# EAGLE design CNC-InterfaceBoard (EAGLE 6.3)
CNC Control Panel Interface Board SPI slave interface Passthrough topology (external LPT master support) Crossbar switch using buffers MCU as crossbar switch controller Charge pump detection/generation E-Stop detection LED control for current master UI
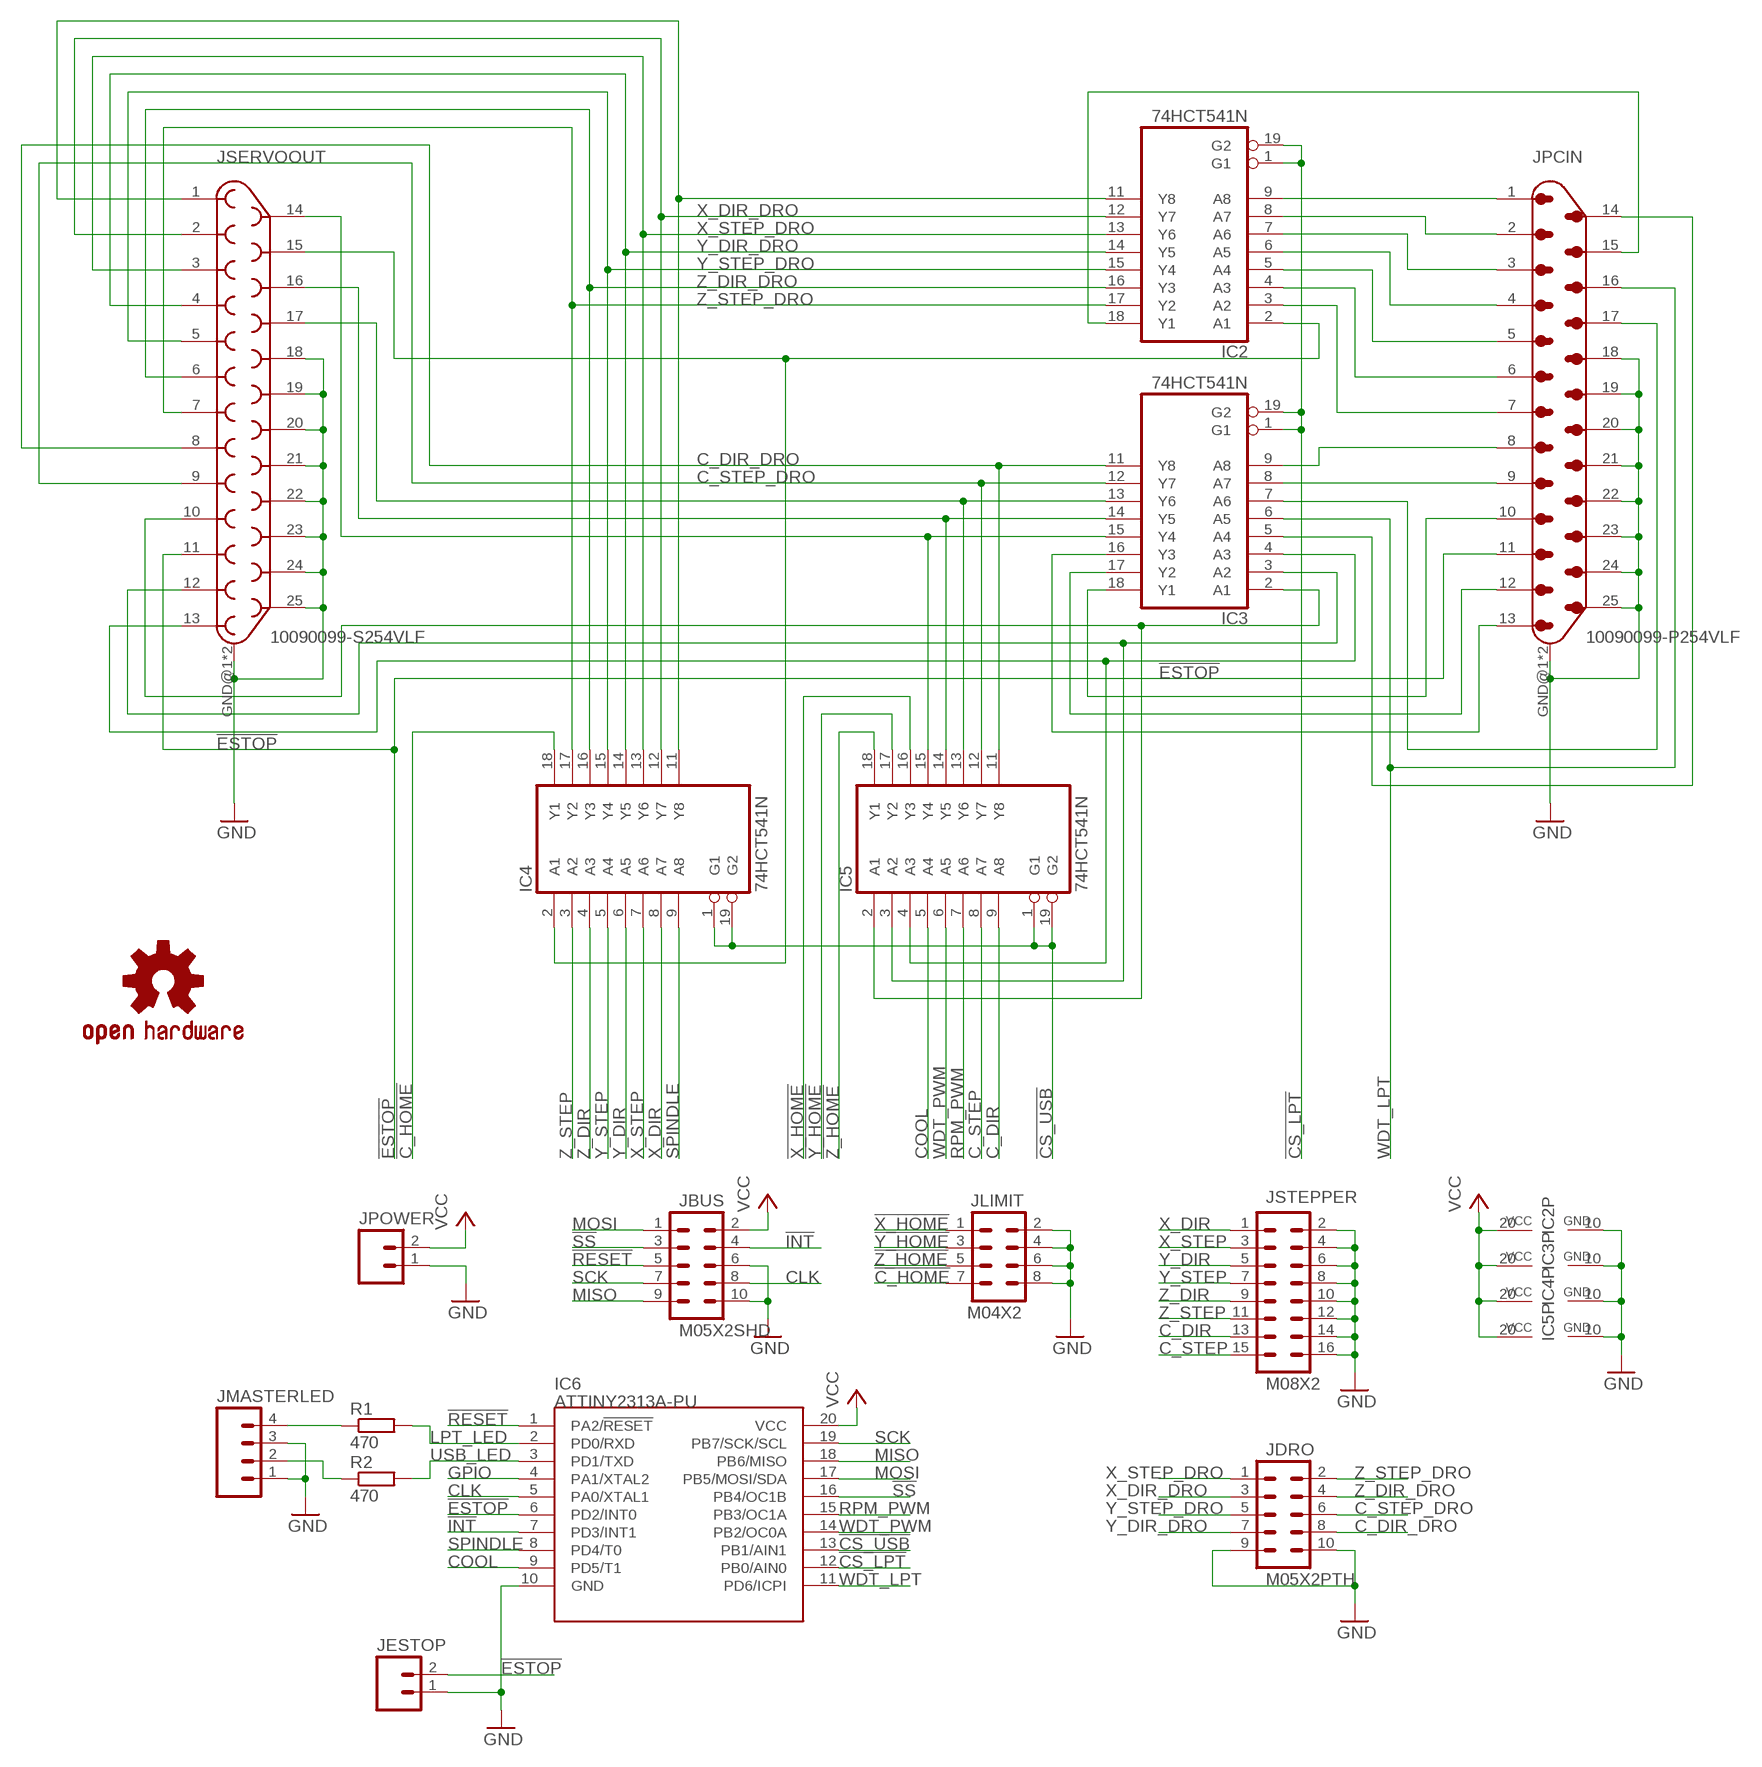
[diagram p0: schematic, sheet 1]

## Parts
IC2  74HCT541N  [DIL20]
IC3  74HCT541N  [DIL20]
IC4  74HCT541N  [DIL20]
IC5  74HCT541N  [DIL20]
IC6  ATTINY2313A-PU  [DIP254P762X533-20]
JBUS  M05X2SHD  [2X5-SHROUDED]
JDRO  M05X2PTH  [AVR_ICSP]
JESTOP  M02PTH  [1X02]
JLIMIT  M04X2  [2X4]
JMASTERLED  M04PTH  [1X04]
JPCIN  10090099-P254VLF  [10090099-P254VLF]
JPOWER  M02POLAR  [MOLEX-1X2]
JSERVOOUT  10090099-S254VLF  [10090099-S254VLF]
JSTEPPER  M08X2  [2X8]
R1  470  R-EU_0207/10  [0207/10]
R2  470  R-EU_0207/10  [0207/10]
U$1  SPARKFUN_OSHW-LOGOL  [SPARKFUN_OSHW-LOGO-L]

## Nets
!C_HOME: IC4.18(Y1) JLIMIT.7
!CS_LPT: IC2.1(G1) IC2.19(G2) IC3.1(G1) IC3.19(G2) IC6.12(PB0/AIN0)
!CS_USB: IC4.1(G1) IC4.19(G2) IC5.1(G1) IC5.19(G2) IC6.13(PB1/AIN1)
!ESTOP: IC6.6(PD2/INT0) JESTOP.2 JPCIN.11 JSERVOOUT.11
!INT: IC6.7(PD3/INT1) JBUS.4
!RESET: IC6.1(PA2/!RESET) JBUS.5
!SS: IC6.16(PB4/OC1B) JBUS.3
!X_HOME: IC5.16(Y3) JLIMIT.1
!Y_HOME: IC5.17(Y2) JLIMIT.3
!Z_HOME: IC5.18(Y1) JLIMIT.5
C_DIR: IC5.9(A8) JSTEPPER.13
C_DIR_DRO: IC3.11(Y8) IC5.11(Y8) JDRO.8 JSERVOOUT.8
C_STEP: IC5.8(A7) JSTEPPER.15
C_STEP_DRO: IC3.12(Y7) IC5.12(Y7) JDRO.6 JSERVOOUT.9
CLK: IC6.5(PA0/XTAL1) JBUS.8
COOL: IC5.5(A4) IC6.9(PD5/T1)
GND: IC2.10(GND) IC3.10(GND) IC4.10(GND) IC5.10(GND) IC6.10(GND) JBUS.6 JBUS.10 JDRO.9 JDRO.10 JESTOP.1 JLIMIT.2 JLIMIT.4 JLIMIT.6 JLIMIT.8 JMASTERLED.1 JMASTERLED.3 JPCIN.18 JPCIN.19 JPCIN.20 JPCIN.21 JPCIN.22 JPCIN.23 JPCIN.24 JPCIN.25 JPCIN.GND@1(GND) JPCIN.GND@2(GND) JPOWER.1 JSERVOOUT.18 JSERVOOUT.19 JSERVOOUT.20 JSERVOOUT.21 JSERVOOUT.22 JSERVOOUT.23 JSERVOOUT.24 JSERVOOUT.25 JSERVOOUT.GND@1(GND) JSERVOOUT.GND@2(GND) JSTEPPER.2 JSTEPPER.4 JSTEPPER.6 JSTEPPER.8 JSTEPPER.10 JSTEPPER.12 JSTEPPER.14 JSTEPPER.16
GPIO: IC6.4(PA1/XTAL2)
LPT_LED: IC6.2(PD0/RXD) R1.2
MISO: IC6.18(PB6/MISO) JBUS.9
MOSI: IC6.17(PB5/MOSI/SDA) JBUS.1
N$1: IC2.9(A8) JPCIN.1
N$2: IC2.8(A7) JPCIN.2
N$3: IC2.7(A6) JPCIN.3
N$4: IC2.6(A5) JPCIN.4
N$5: IC2.5(A4) JPCIN.5
N$6: IC2.4(A3) JPCIN.6
N$7: IC2.3(A2) JPCIN.7
N$8: IC3.9(A8) JPCIN.8
N$9: IC3.8(A7) JPCIN.9
N$10: IC3.5(A4) JPCIN.14
N$11: JMASTERLED.2 R2.1
N$12: IC3.2(A1) IC5.2(A1) JSERVOOUT.10
N$13: IC3.3(A2) IC5.3(A2) JSERVOOUT.12
N$14: IC3.7(A6) JPCIN.17
N$15: IC3.4(A3) IC5.4(A3) JSERVOOUT.13
N$16: JMASTERLED.4 R1.1
N$17: IC3.16(Y3) JPCIN.13
N$18: IC3.17(Y2) JPCIN.12
N$19: IC2.18(Y1) JPCIN.15
N$21: IC3.18(Y1) JPCIN.10
N$22: IC3.15(Y4) IC5.15(Y4) JSERVOOUT.14
N$23: IC3.14(Y5) IC5.14(Y5) JSERVOOUT.16
N$24: IC3.13(Y6) IC5.13(Y6) JSERVOOUT.17
N$34: IC2.2(A1) IC4.2(A1) JSERVOOUT.15
N$38: IC2.11(Y8) IC4.11(Y8) JSERVOOUT.1
RPM_PWM: IC5.7(A6) IC6.15(PB3/OC1A)
SCK: IC6.19(PB7/SCK/SCL) JBUS.7
SPINDLE: IC4.9(A8) IC6.8(PD4/T0)
USB_LED: IC6.3(PD1/TXD) R2.2
VCC: IC2.20(VCC) IC3.20(VCC) IC4.20(VCC) IC5.20(VCC) IC6.20(VCC) JBUS.2 JPOWER.2
WDT_LPT: IC3.6(A5) IC6.11(PD6/ICPI) JPCIN.16
WDT_PWM: IC5.6(A5) IC6.14(PB2/OC0A)
X_DIR: IC4.8(A7) JSTEPPER.1
X_DIR_DRO: IC2.12(Y7) IC4.12(Y7) JDRO.3 JSERVOOUT.2
X_STEP: IC4.7(A6) JSTEPPER.3
X_STEP_DRO: IC2.13(Y6) IC4.13(Y6) JDRO.1 JSERVOOUT.3
Y_DIR: IC4.6(A5) JSTEPPER.5
Y_DIR_DRO: IC2.14(Y5) IC4.14(Y5) JDRO.7 JSERVOOUT.4
Y_STEP: IC4.5(A4) JSTEPPER.7
Y_STEP_DRO: IC2.15(Y4) IC4.15(Y4) JDRO.5 JSERVOOUT.5
Z_DIR: IC4.4(A3) JSTEPPER.9
Z_DIR_DRO: IC2.16(Y3) IC4.16(Y3) JDRO.4 JSERVOOUT.6
Z_STEP: IC4.3(A2) JSTEPPER.11
Z_STEP_DRO: IC2.17(Y2) IC4.17(Y2) JDRO.2 JSERVOOUT.7

## Library data of the parts
IC2-IC5 = 74xx-eu:74*541: Octal BUFFER and LINE DRIVER, 3-state
IC6 = SparkFun-DigitalIC:ATTINY2313A: Atmel ATtiny2313A 2KiB Flash, 128 Bytes SRAM, 128 Bytes EEPROM 18 GPIO, USART, USI, picoPower DIP and SOIC packages provided
JBUS JDRO = SparkFun-Connectors:M05X2: Header 5x2 Standard 10-pin dual row 0.1" header. Commonly used with AVR-ISP. Use with Spark Fun Electronics SKU: PRT-00778
JESTOP JPOWER = SparkFun-Connectors:M02: Header 2 Standard 2-pin 0.1" header. Use with straight break away headers (SKU : PRT-00116), right angle break away headers (PRT-00553), swiss pins (PRT-00743), machine pins (PRT-00117), and female headers (PRT-00115). Molex polarized connector foot print use with SKU : PRT-08233 with associated crimp pins and housings.
JLIMIT = SparkFun-Connectors:M04X2: .1" header, two rows of four.
JMASTERLED = SparkFun-Connectors:M04: Header 4 Standard 4-pin 0.1" header. Use with straight break away headers (SKU : PRT-00116), right angle break away headers (PRT-00553), swiss pins (PRT-00743), machine pins (PRT-00117), and female headers (PRT-00115). Molex polarized connector foot print use with SKU : PRT-08231 with associated crimp pins and housings. 1MM SMD Version SKU: PRT-10208
JPCIN = radu-collected:10090099-P254VLF: FCI 10090099-P254[VLX]LF DB-25 male connector, right angle PCB mount
JSERVOOUT = radu-collected:10090099-S254VLF: FCI 10090099-S254[VLX]LF DB-25 female connector, right angle PCB mount
JSTEPPER = SparkFun-Connectors:M08X2: .1" headers, two rows of 8 each
R1 R2 = rcl:R-EU_: RESISTOR, European symbol
U$1 = Si4735_Breakout-v10:SPARKFUN_OSHW-LOGO: Open Source Hardware Logo This logo indicates the piece of hardware it is found on incorporates a OSHW license and/or adheres to the definition of open source hardware found here: http://freedomdefined.org/OSHW

## Net classes
0 default: width 0.254 mm, clearance 0.318 mm

## Board
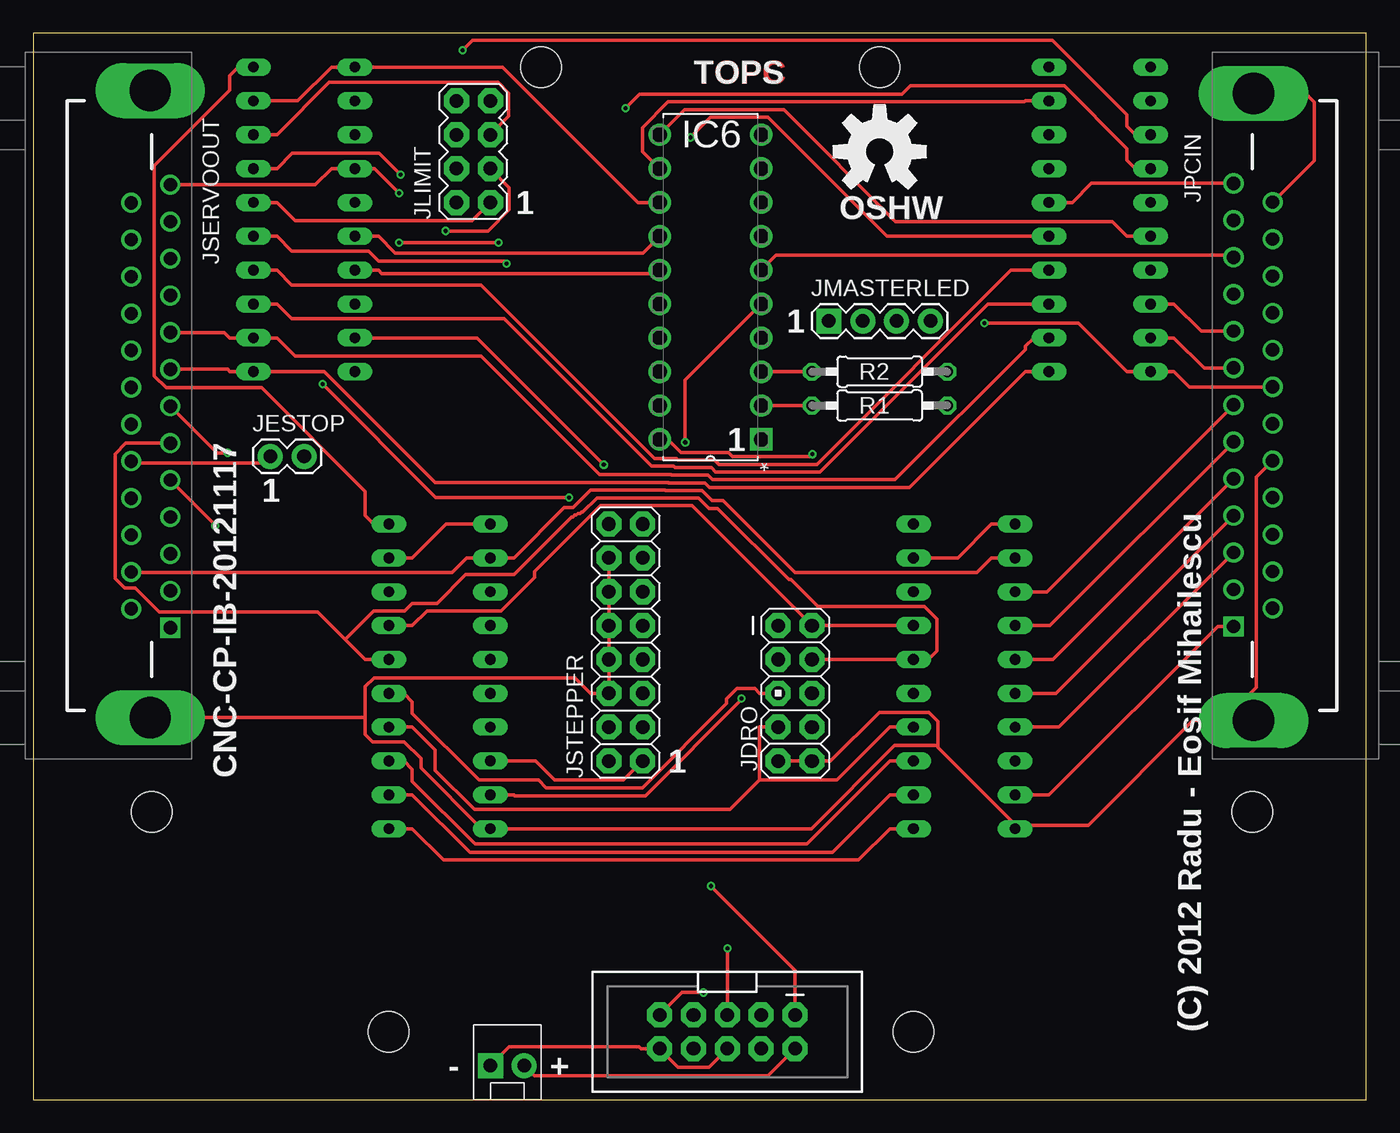
[diagram p1: board, top side]
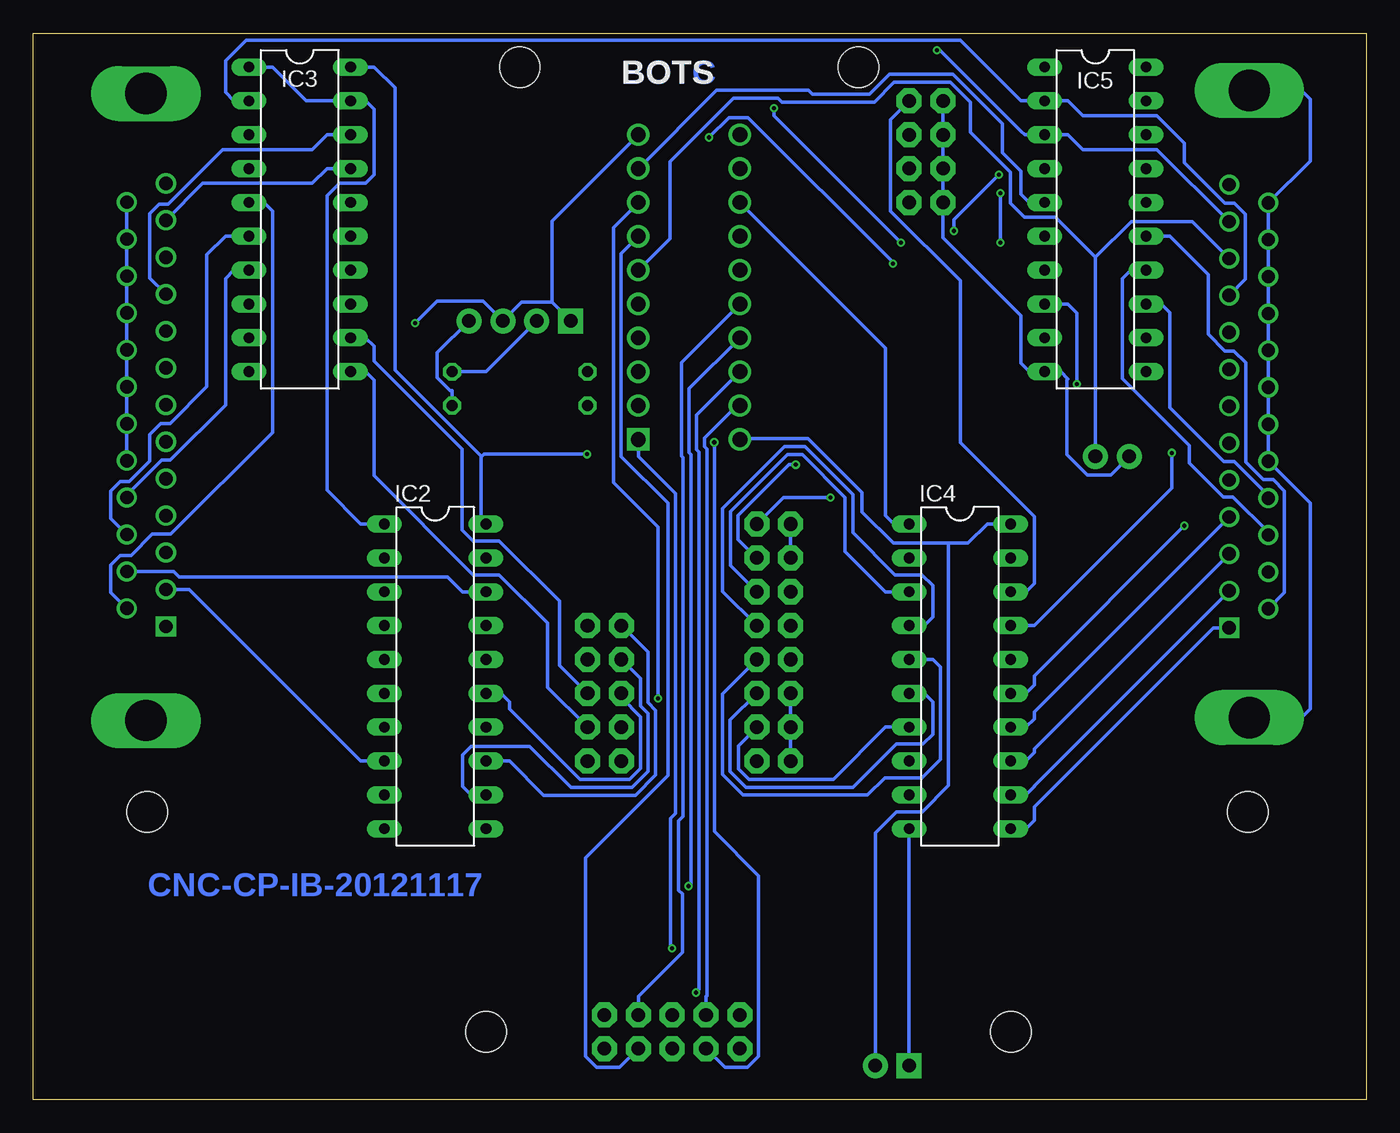
[diagram p2: board, bottom side, seen from below]

Size 100 x 80 mm. Coordinates in mm from the lower left corner, seen from the top.
Outline: 0,0 100,0 100,80 0,80 0,0
Copper layers (1*16): Top 0.035mm / dielectric 1.5mm / Bottom 0.035mm
Design rules "ITEADstudio_DRC": minimum track width 6mil, minimum drill 12mil, track to track 6mil, track to pad 6mil, pad to pad 6mil, via to via 6mil, smd to smd 0mil, copper to edge 10mil, drill to drill 10mil, minimum pad ring 10mil, minimum via ring 6mil, stop-mask expansion 2mil, vias tented up to drill 100mil, thermal gap 10mil
Holes 3.05 mm at 38.1,77.47 26.67,5.08 66.04,5.08 63.5,77.47 8.89,21.59 91.44,21.59

### Footprints (pad centres in the part's own frame; a part is rotated, then mirrored left to right if it is on the bottom)
DIL20 = drill 0.813 long: 1 -11.43,-3.81; 2 -8.89,-3.81; 3 -6.35,-3.81; 4 -3.81,-3.81; 5 -1.27,-3.81; 6 1.27,-3.81; 7 3.81,-3.81; 8 6.35,-3.81; 9 8.89,-3.81; 10 11.43,-3.81; 11 11.43,3.81; 12 8.89,3.81; 13 6.35,3.81; 14 3.81,3.81; 15 1.27,3.81; 16 -1.27,3.81; 17 -3.81,3.81; 18 -6.35,3.81; 19 -8.89,3.81; 20 -11.43,3.81
DIP254P762X533-20 = drill 1.118 square: 1 -7.62,22.86 | drill 1.118: 2 -7.62,20.32; 3 -7.62,17.78; 4 -7.62,15.24; 5 -7.62,12.7; 6 -7.62,10.16; 7 -7.62,7.62; 8 -7.62,5.08; 9 -7.62,2.54; 10 -7.62,0; 11 0,0; 12 0,2.54; 13 0,5.08; 14 0,7.62; 15 0,10.16; 16 0,12.7; 17 0,15.24; 18 0,17.78; 19 0,20.32; 20 0,22.86
2X5-SHROUDED = drill 1.016 pad 1.88 octagon: 1 -1.27,5.08; 2 1.27,5.08; 3 -1.27,2.54; 4 1.27,2.54; 5 -1.27,0; 6 1.27,0; 7 -1.27,-2.54; 8 1.27,-2.54; 9 -1.27,-5.08; 10 1.27,-5.08
AVR_ICSP = drill 1.016 pad 1.88 octagon: 1 -1.27,5.08; 2 1.27,5.08; 3 -1.27,2.54; 4 1.27,2.54; 5 -1.27,0; 6 1.27,0; 7 -1.27,-2.54; 8 1.27,-2.54; 9 -1.27,-5.08; 10 1.27,-5.08
1X02 = drill 1.016 pad 1.88: 1 0,0; 2 2.54,0
2X4 = drill 1.016 pad 1.88 octagon: 1 -3.81,-1.27; 2 -3.81,1.27; 3 -1.27,-1.27; 4 -1.27,1.27; 5 1.27,-1.27; 6 1.27,1.27; 7 3.81,-1.27; 8 3.81,1.27
1X04 = drill 1.016 pad 1.88 square: 1 0,0 | drill 1.016 pad 1.88: 2 2.54,0; 3 5.08,0; 4 7.62,0
10090099-P254VLF = drill 1 square: 1 -1.39,-16.57 | drill 1: 2 -1.39,-13.8; 3 -1.39,-11.03; 4 -1.39,-8.26; 5 -1.39,-5.49; 6 -1.39,-2.72; 7 -1.39,0.05; 8 -1.39,2.82; 9 -1.39,5.59; 10 -1.39,8.36; 11 -1.39,11.13; 12 -1.39,13.9; 13 -1.39,16.67; 14 1.545,-15.215; 15 1.545,-12.445; 16 1.545,-9.675; 17 1.545,-6.905; 18 1.545,-4.135; 19 1.545,-1.365; 20 1.545,1.405; 21 1.545,4.175; 22 1.545,6.945; 23 1.545,9.715; 24 1.545,12.485; 25 1.545,15.255 | drill 3.1 long: GND@1 0.12,23.41; GND@2 0.12,-23.63
MOLEX-1X2 = drill 1.016 pad 1.88 square: 1 0,0 | drill 1.016 pad 1.88: 2 2.54,0
10090099-S254VLF = drill 1 square: 1 -1.39,16.67 | drill 1: 2 -1.39,13.9; 3 -1.39,11.13; 4 -1.39,8.36; 5 -1.39,5.59; 6 -1.39,2.82; 7 -1.39,0.05; 8 -1.39,-2.72; 9 -1.39,-5.49; 10 -1.39,-8.26; 11 -1.39,-11.03; 12 -1.39,-13.8; 13 -1.39,-16.57; 14 1.545,15.255; 15 1.545,12.485; 16 1.545,9.715; 17 1.545,6.945; 18 1.545,4.175; 19 1.545,1.405; 20 1.545,-1.365; 21 1.545,-4.135; 22 1.545,-6.905; 23 1.545,-9.675; 24 1.545,-12.445; 25 1.545,-15.215 | drill 3.1 long: GND@1 0.12,23.41; GND@2 0.12,-23.63
2X8 = drill 1.016 pad 1.88 octagon: 1 0,0; 2 0,2.54; 3 2.54,0; 4 2.54,2.54; 5 5.08,0; 6 5.08,2.54; 7 7.62,0; 8 7.62,2.54; 9 10.16,0; 10 10.16,2.54; 11 12.7,0; 12 12.7,2.54; 13 15.24,0; 14 15.24,2.54; 15 17.78,0; 16 17.78,2.54
0207/10 = drill 0.813 octagon: 1 -5.08,0; 2 5.08,0

### Placement (x,y rotation side)
IC2  69.85,31.75 270 bottom
IC3  80.01,66.04 270 bottom
IC4  30.48,31.75 270 bottom
IC5  20.32,66.04 270 bottom
IC6  46.99,72.39 180 top
JBUS  52.07,5.08 270 top
JDRO  57.15,30.48 0 top
JESTOP  17.78,48.26 0 top
JLIMIT  33.02,71.12 90 top
JMASTERLED  59.69,58.42 0 top
JPCIN  91.44,52.07 0 top
JPOWER  34.29,2.54 0 top
JSERVOOUT  8.89,52.07 180 top
JSTEPPER  45.72,25.4 90 top
R1  63.5,52.07 180 top
R2  63.5,54.61 180 top
U$1  63.5,71.12 0 top

### Tracks (layer width: path | path; a pad name or v marks a point on that pad's centre or on a via)
!C_HOME
  Bottom 0.254: IC4.18 25.54,38.1 24.9,38.73 24.9,43.73 30.45,49.28 30.45,61.43 35.69,66.67 35.69,73.53 JLIMIT.7
!CS_LPT
  Top 0.254: IC3.19 74.43,74.93 74.36,74.86 47.63,74.86 45.7,72.94 45.7,71.14 IC6.12 | IC2.19 67.81,40.64 69.36,40.64 71.89,43.18 IC2.1
  Bottom 0.254: IC2.1 75.42,43.18 77.97,45.72 77.97,67.81 77.03,68.75 75.07,68.75 74.43,69.38 74.43,74.3 75.07,74.93 IC3.19 79.51,74.93 82.06,77.47 IC3.1
!CS_USB
  Top 0.254: IC6.13 45.37,67.31 35.21,77.47 IC5.1 22.36,77.47 19.82,74.93 17.39,74.93 IC5.19 | IC4.19 28.44,40.64 30.98,43.18 IC4.1
  Bottom 0.254: IC4.1 35.42,43.18 36.06,43.81 36.06,56.38 IC6.13
!ESTOP
  Top 0.254: IC6.6 55.73,63.35 89.9,63.35 JPCIN.11
  Bottom 0.254: 20.32,63.19 23.33,66.2 25.63,66.2 26.68,67.26 26.68,69.59 29.69,72.59 29.69,74.82 31.19,76.33 35.43,76.33 36.91,74.85 43.83,74.85 44.12,75.14 47.48,75.14 52.24,70.38 52.24,64.6 IC6.6 | 20.32,63.19 JESTOP.2 | JSERVOOUT.11 13.06,65.88 17.64,65.88 20.32,63.19
!INT
  Bottom 0.254: JBUS.4 56,2.42 57.74,2.42 58.55,3.23 58.55,18.14 52.39,24.3 52.39,44.74 55.89,48.25 55.89,63.49 IC6.7
!RESET  (via drill 0.3 pad 0.61)
  Top 0.254: JBUS.5 v52.07,11.34
  Bottom 0.254: v52.07,11.34 52.2,11.47 52.2,21.11 51.82,21.49 51.82,45.45 54.61,48.25 IC6.1
!SS
  Bottom 0.254: IC6.16 51.38,55.3 51.38,48.29 51.24,48.16 51.24,21.25 51.59,20.91 51.59,15.71 51.31,15.43 51.31,11.04 54.61,7.73 JBUS.3
!X_HOME
  Top 0.254: JLIMIT.1 32.91,65.92 19.66,65.92 18.28,67.31 IC5.16
!Y_HOME  (via drill 0.3 pad 0.61)
  Top 0.254: IC5.17 18.28,69.85 19.42,71 25.93,71 v27.55,69.38 | JLIMIT.3 35.71,68.43 35.71,66.75 34.13,65.17 v30.93,65.17
  Bottom 0.254: v30.93,65.17 30.93,66 v27.55,69.38
!Z_HOME
  Top 0.254: IC5.18 18.28,72.39 22.2,76.31 34.86,76.31 35.67,75.5 35.67,73.78 JLIMIT.5
C_DIR  (via drill 0.3 pad 0.61)
  Top 0.254: IC5.9 33.28,57.15 v42.8,47.63
  Bottom 0.254: v42.8,47.63 43.32,47.63 47.11,43.84 47.11,42.03 JSTEPPER.13
C_DIR_DRO
  Top 0.254: IC3.11 74.43,54.61 65.75,45.92 50.74,45.92 50.39,46.27 47.65,46.27 47.64,46.29 30.14,46.29 21.82,54.61 IC5.11 14.74,54.61 14.56,54.79 JSERVOOUT.8
  Bottom 0.254: IC3.11 75.07,54.61 74.43,53.98 74.43,46.81 66.99,39.37 65.04,39.37 61.42,35.75 61.42,30.94 JDRO.8
C_STEP  (via drill 0.3 pad 0.61)
  Top 0.254: v21.7,53.67 30.2,45.17 v40.19,45.17
  Bottom 0.254: JSTEPPER.15 43.73,45.17 v40.19,45.17 | v40.19,45.17 | IC5.8 22.36,59.69 21.7,59.02 v21.7,53.67
C_STEP_DRO
  Top 0.254: IC3.12 75.07,57.15 74.43,56.52 74.43,56.29 64.66,46.52 50.96,46.52 50.63,46.85 47.89,46.85 47.86,46.88 42.49,46.88 33.59,55.78 19.64,55.78 18.28,57.15 IC5.12 14.74,57.15 14.34,57.56 JSERVOOUT.9
  Bottom 0.254: IC3.12 75.07,57.15 74.43,56.52 74.43,55.42 67.82,48.81 67.82,42.74 66.99,41.91 65.04,41.91 60.53,37.4 60.53,32.59 JDRO.6
CLK  (via drill 0.3 pad 0.61)
  Top 0.254: v48.91,49.31 48.91,53.99 IC6.5
  Bottom 0.254: JBUS.8 48.12,2.4 46.44,2.4 45.59,3.25 45.59,16.8 48.9,20.1 48.9,49.3 v48.91,49.31
COOL
  Bottom 0.254: IC5.5 25.26,67.31 25.89,67.94 25.89,69.65 27.28,71.03 27.28,73.22 30.99,76.94 35.76,76.94 37.27,75.42 41.54,75.42 41.83,75.72 48.74,75.72 IC6.9
GND  (via drill 0.3 pad 0.61)
  Top 0.254: 67.87,26.55 64.61,26.55 58.38,20.32 IC4.10 33.63,20.32 29.08,24.87 29.08,25.58 27.83,26.84 25.48,26.84 24.9,27.41 24.9,28.66 | JSERVOOUT.18 7.47,47.77 17.29,47.77 JESTOP.1 | JPCIN.GND@1 95.49,75.48 96.12,74.84 96.12,70.46 JPCIN.25 | 89.28,28.44 91.77,30.93 91.77,46.72 JPCIN.18 | 89.28,28.44 87,28.44 79.14,20.58 73.72,20.58 | JPCIN.GND@2 89.28,28.44 | 73.72,20.58 73.72,20.38 IC2.10 | 67.87,26.55 67.87,26.43 73.72,20.58 | JSTEPPER.14 JSTEPPER.12 JSTEPPER.10 JSTEPPER.8 JSTEPPER.6 41.8,30.48 40.65,31.63 25.55,31.63 24.9,30.98 24.9,28.66 | JPCIN.20 86.72,53.48 85.58,54.61 IC3.10 82.06,54.61 78.41,58.26 v71.36,58.26 | 67.87,26.55 67.87,28.38 67.19,29.06 63.46,29.06 59.8,25.4 JDRO.10 JDRO.9 | 24.9,28.66 13.33,28.66 JSERVOOUT.GND@1 | JBUS.6 50.68,2.42 48.38,2.42 JBUS.10 45.6,3.81 45.46,3.95 35.7,3.95 JPOWER.1
  Bottom 0.254: JESTOP.1 19.17,46.87 20.93,46.87 22.45,48.38 22.45,53.98 22.36,54.06 22.91,54.61 IC5.10 25.26,54.61 25.89,55.24 25.89,58.83 31.75,64.68 31.75,65.92 JLIMIT.2 JLIMIT.4 JLIMIT.6 JLIMIT.8 | JSTEPPER.2 43.18,26.79 JSTEPPER.4 JSTEPPER.6 | v71.36,58.26 69.72,59.89 66.24,59.89 JMASTERLED.3 63.38,59.81 61.09,59.81 | 61.09,59.81 JMASTERLED.1 | 61.09,59.81 61.09,65.92 IC6.10 | IC4.10 JPOWER.1 | JPCIN.18 JPCIN.19 JPCIN.20 JPCIN.21 JPCIN.22 JPCIN.23 JPCIN.24 JPCIN.25 | JSERVOOUT.GND@1 4.84,28.66 4.21,29.3 4.21,44.76 JSERVOOUT.18 JSERVOOUT.19 JSERVOOUT.20 JSERVOOUT.21 JSERVOOUT.22 JSERVOOUT.23 JSERVOOUT.24 JSERVOOUT.25 4.21,70.42 4.21,75.06 4.84,75.7 JSERVOOUT.GND@2 | JSTEPPER.16 JSTEPPER.14
LPT_LED
  Top 0.254: R1.2 IC6.2
MISO  (via drill 0.3 pad 0.61)
  Top 0.254: JBUS.9 48.67,8.03 v50.28,8.03
  Bottom 0.254: v50.28,8.03 50.04,8.27 50.04,48.57 50.23,48.76 50.23,51.37 IC6.18
MOSI  (via drill 0.3 pad 0.61)
  Top 0.254: JBUS.1 57.15,9.69 v50.83,16.01
  Bottom 0.254: v50.83,16.01 50.67,16.17 50.67,48.4 50.8,48.53 50.8,53.34 IC6.17
N$1
  Top 0.254: IC2.9 76.21,22.86 88.85,35.5 JPCIN.1
N$2
  Bottom 0.254: IC2.8 75.42,25.4 88.3,38.27 JPCIN.2
N$3
  Top 0.254: JPCIN.3 76.95,27.94 IC2.7
N$4
  Top 0.254: JPCIN.4 76.72,30.48 IC2.6
N$5
  Top 0.254: JPCIN.5 76.49,33.02 IC2.5
N$6
  Top 0.254: JPCIN.6 76.26,35.56 IC2.4
N$7
  Top 0.254: JPCIN.7 76.03,38.1 IC2.3
N$8
  Top 0.254: IC3.9 85.58,57.15 87.85,54.89 JPCIN.8
N$9
  Top 0.254: IC3.8 85.58,59.69 87.61,57.66 JPCIN.9
N$10
  Bottom 0.254: IC3.5 82.69,67.31 82.06,66.67 82.06,50.05 89.68,42.42 91.07,42.42 92.67,40.82 93.48,40.82 94.19,40.12 94.19,38.06 JPCIN.14
N$11
  Bottom 0.254: R2.1 66.04,54.61 JMASTERLED.2
N$12
  Bottom 0.254: JSERVOOUT.10 9.06,61.55 9.06,66.42 9.89,67.25 10.62,67.25 13.66,70.3 13.66,71.77 15.71,73.83 21.26,73.83 22.36,74.93 IC5.2 25.89,74.93 30.46,79.49 84.03,79.49 85.58,77.94 85.58,75.56 84.95,74.93 IC3.2
N$13  (via drill 0.3 pad 0.61)
  Top 0.254: v32.2,78.74 32.96,79.5 76.46,79.5 82.06,73.9 82.06,73.03 82.69,72.39 IC3.3
  Bottom 0.254: JSERVOOUT.12 15.7,71.28 21.26,71.28 22.36,72.39 IC5.3 25.62,72.39 25.89,72.67 31.97,78.74 v32.2,78.74
N$14
  Bottom 0.254: IC3.7 84.95,62.23 85.58,61.59 85.58,52.1 89.72,47.97 90.38,47.97 92.98,45.36 JPCIN.17
N$15  (via drill 0.3 pad 0.61)
  Top 0.254: IC3.4 82.69,69.85 82.06,70.48 82.06,71.36 77.35,76.07 65.79,76.07 65.16,75.43 45.47,75.43 v44.43,74.39 | v34.91,64.29 v27.44,64.29 | JSERVOOUT.13 21.15,68.64 22.36,69.85 IC5.4 25.59,69.85 25.89,69.55 v27.44,68
  Bottom 0.254: v34.91,64.29 44.43,73.81 v44.43,74.39 | v27.44,68 v27.44,64.29
N$16
  Bottom 0.254: R1.1 68.58,53.17 68.72,53.17 69.7,54.15 69.7,56.03 JMASTERLED.4
N$17
  Top 0.254: IC3.16 77.97,67.31 79.39,68.74 JPCIN.13
N$18
  Bottom 0.254: IC3.17 77.97,69.85 79.07,68.75 87.28,68.75 JPCIN.12
N$19
  Bottom 0.254: IC2.18 67.81,38.1 68.91,39.2 89.04,39.2 89.46,39.62 JPCIN.15
N$21
  Bottom 0.254: IC3.18 77.97,72.39 79.07,71.28 85.78,71.28 89.89,67.17 90.55,67.17 91.25,66.46 91.25,61.63 JPCIN.10
N$22  (via drill 0.3 pad 0.61)
  Top 0.254: IC5.15 18.28,64.77 19.38,63.66 25.14,63.66 25.9,62.91 35.34,62.91 v35.52,62.73 | v49.31,72.19 50.81,73.69 55.12,73.69 64.05,64.77 IC3.15
  Bottom 0.254: v35.52,62.73 35.52,62.84 46.36,73.69 47.82,73.69 v49.31,72.19 | IC5.15 14.74,64.77 11.86,61.88 11.86,57.44 10.59,56.17 9.93,56.17 9.03,55.28 9.03,47.83 7.71,46.51 6.98,46.51 6.13,45.66 6.13,38.03 JSERVOOUT.14
N$23
  Top 0.254: IC3.14 73.35,62.23 58.78,47.66 51.43,47.66 51.1,47.99 48.37,47.99 48.27,48.09 46.62,48.09 33.58,61.12 19.38,61.12 18.28,62.23 IC5.14
  Bottom 0.254: IC5.14 17.64,62.23 18.28,61.59 18.28,54.08 13.27,49.07 13.27,47.76 10.72,45.21 9.99,45.21 7.34,42.56 JSERVOOUT.16
N$24
  Top 0.254: IC3.13 71.62,59.69 59.01,47.09 51.2,47.09 50.87,47.42 48.13,47.42 48.03,47.52 46.38,47.52 35.31,58.59 19.38,58.59 18.28,59.69 IC5.13
  Bottom 0.254: IC5.13 15.38,59.69 14.74,59.05 14.74,51.93 10.68,47.87 9.88,47.87 7.34,45.33 JSERVOOUT.17
N$34
  Top 0.254: IC2.2 71.89,40.64 70.79,39.53 57.13,39.53 51.74,44.93 50.93,44.93 50.16,45.7 47.42,45.7 47.4,45.72 41.8,45.72 40.5,44.42 39.84,44.42 36.06,40.64 IC4.2 32.52,40.64 31.42,39.53 7.4,39.53 JSERVOOUT.15
N$38
  Top 0.254: IC2.11 64.28,20.32 61.92,17.97 30.79,17.97 28.44,20.32 IC4.11
  Bottom 0.254: IC4.11 25.54,20.32 24.9,20.95 24.9,21.97 11.48,35.4 JSERVOOUT.1
RPM_PWM
  Top 0.254: IC6.15 46.74,61.98 26.14,61.98 25.89,62.23 IC5.7
SCK
  Bottom 0.254: IC6.19 47.21,52.07 49.66,49.62 49.66,49 49.47,48.81 49.47,7.8 49.53,7.73 JBUS.7
SPINDLE  (via drill 0.3 pad 0.61)
  Top 0.254: v53.14,30.09 53.14,30 45.94,22.8 36.12,22.8 36.06,22.86 IC4.9
  Bottom 0.254: v53.14,30.09 53.14,42.96 56.49,46.31 56.49,65.43 IC6.8
USB_LED
  Top 0.254: R2.2 IC6.3
VCC  (via drill 0.3 pad 0.61)
  Top 0.254: IC6.20 47.63,49.53 48.6,48.56 52.15,48.56 52.46,48.25 58.3,48.25 v58.47,48.42 | IC5.20 15.38,77.47 14.74,76.83 14.74,75.72 9.08,70.05 9.08,54.29 9.96,53.41 17.14,53.41 24.9,45.64 24.9,43.81 25.54,43.18 IC4.20 | JPOWER.2 37.59,1.78 55.12,1.78 JBUS.2
  Bottom 0.254: 31.33,41.74 35.47,41.74 37.82,44.09 37.82,45.54 41.87,49.59 46.94,49.59 IC6.20 | 31.33,41.74 29.87,41.74 28.44,43.18 IC4.20 | JPOWER.2 36.83,20.01 35.25,21.59 33.31,21.59 31.33,23.57 31.33,41.74 | 66.36,48.23 66.18,48.42 v58.47,48.42 | 66.36,48.23 66.4,48.19 66.4,43.18 IC2.20 | 66.36,48.23 72.87,54.73 72.87,75.9 74.43,77.47 IC3.20
WDT_LPT
  Top 0.254: IC6.11 48.86,74.26 56.31,74.26 64.7,65.88 80.95,65.88 82.06,64.77 IC3.6
  Bottom 0.254: JPCIN.16 94.19,43.6 94.19,45.66 93.48,46.36 92.82,46.36 91.26,47.92 91.26,49.91 90.43,50.73 89.74,50.73 86.98,53.5 86.98,63.38 85.58,64.77 IC3.6
WDT_PWM
  Top 0.254: IC5.6 25.89,64.77 27.16,63.51 45.73,63.51 IC6.14
X_DIR
  Top 0.254: JSTEPPER.1 44.28,23.96 39.11,23.96 37.67,25.4 36.06,25.4 IC4.8
X_DIR_DRO
  Top 0.254: IC2.12 64.28,22.86 59.95,18.54 32.76,18.54 28.44,22.86 IC4.12
  Bottom 0.254: IC2.12 67.17,22.86 67.81,23.5 67.81,25.87 67.16,26.51 62.78,26.51 59.67,23.4 55.07,23.4 53.87,24.61 53.87,28.96 54.46,29.54 54.46,31.6 JDRO.3 | IC4.12 25.54,22.86 24.9,23.5 24.9,23.55 JSERVOOUT.2
X_STEP
  Bottom 0.254: IC4.7 36.06,27.94 39.98,24.01 46.3,24.01 47.11,24.82 47.11,26.55 JSTEPPER.3
X_STEP_DRO
  Top 0.254: IC2.13 64.28,25.4 58.04,19.17 33.15,19.17 28.44,23.89 28.44,24.77 27.8,25.4 IC4.13
  Bottom 0.254: JDRO.1 53.89,33.57 53.89,29.78 53.3,29.2 53.3,24.37 54.84,22.83 61.71,22.83 64.28,25.4 IC2.13 | IC4.13 25.54,25.4 24.9,26.04 24.9,26.32 JSERVOOUT.3
Y_DIR
  Bottom 0.254: JSTEPPER.5 47.71,28.49 47.71,24.61 46.52,23.42 38.5,23.42 35.24,26.67 33.26,26.67 32.52,27.41 32.52,29.84 33.16,30.48 IC4.6
Y_DIR_DRO
  Top 0.254: 54.49,23.98 52.27,21.75 33.09,21.75 30.14,24.71 30.14,26.24 28.44,27.94 IC4.14 | 54.49,23.98 54.49,27.94 JDRO.7 | 54.49,23.98 60.31,23.98 64.28,27.94 IC2.14
  Bottom 0.254: IC4.14 25.54,27.94 24.9,28.57 24.9,29.09 JSERVOOUT.4
Y_STEP
  Bottom 0.254: IC4.5 32.52,33.02 31.95,32.44 31.95,25.52 33.33,24.13 36.12,24.13 37.4,22.84 46.76,22.84 48.3,24.39 48.3,30.44 JSTEPPER.7
Y_STEP_DRO  (via drill 0.3 pad 0.61)
  Top 0.254: IC4.15 27.8,30.48 28.44,29.84 28.44,28.99 33.46,23.96 37.89,23.96 38.48,23.38 45.69,23.38 52.02,29.71 52.02,30.05 52.8,30.84 54.13,30.84 54.49,30.48 JDRO.5 | JSERVOOUT.5 13.64,43.12 v13.64,43.05
  Bottom 0.254: IC2.15 64.91,30.48 64.28,29.84 64.28,29.29 58.99,24.01 55.28,24.01 54.45,24.84 54.45,28.72 55.88,30.16 JDRO.5 | IC4.15 25.54,30.48 24.9,31.11 24.9,31.79 v13.64,43.05
Z_DIR
  Bottom 0.254: JSTEPPER.9 48.29,38.13 48.29,44.34 43.63,49 42.11,49 38.52,45.41 38.52,42.54 35.35,39.37 33.33,39.37 32.52,38.56 32.52,36.2 33.16,35.56 IC4.4
Z_DIR_DRO
  Top 0.254: 23.39,34.53 25.52,36.66 27.86,36.66 28.44,37.24 30.28,37.24 32.44,39.4 36.06,39.4 40.37,43.71 40.48,43.71 40.62,43.85 40.74,43.85 40.85,43.97 41.01,43.97 41.13,44.08 41.22,44.08 42.28,45.15 47.17,45.15 47.18,45.13 49.92,45.13 50.69,44.36 51.35,44.36 56.7,39 56.86,39 58.86,36.99 66.85,36.99 67.81,36.04 67.81,33.66 67.17,33.02 IC2.16 JDRO.4 | 23.39,34.53 21.33,36.6 9.44,36.6 7.66,38.39 6.85,38.39 6.14,39.1 6.14,48.44 6.95,49.25 JSERVOOUT.6 | 23.39,34.53 24.9,33.02 IC4.16
Z_STEP
  Bottom 0.254: JSTEPPER.11 47.7,40.08 47.7,44.11 43.42,48.39 42.31,48.39 39.09,45.17 39.09,41.14 36.06,38.1 IC4.3
Z_STEP_DRO  (via drill 0.3 pad 0.61)
  Top 0.254: JSERVOOUT.7 13.78,48.52 v14.58,48.52 | IC2.17 64.28,35.56 JDRO.2 49.42,44.56 46.94,44.56 46.93,44.57 42.57,44.57 37.6,39.61 37.6,39.17 35.1,36.66 29.54,36.66 28.44,35.56 IC4.17
  Bottom 0.254: IC4.17 24.9,35.56 14.58,45.88 v14.58,48.52

### Text on the board
Top: TOPC
Bottom: BOTC | CNC-CP-IB-20121117
tPlace: TOPS | 1 | OSHW | 1 | 1 | 1 | 1 | CNC-CP-IB-20121117 | (C) 2012 Radu - Eosif Mihailescu | - | +
bPlace: BOTS